# Altium schematic sheet FIT_FPGA_G-H.SchDoc
size A4; SheetNumber: 27; SheetTotal: 29
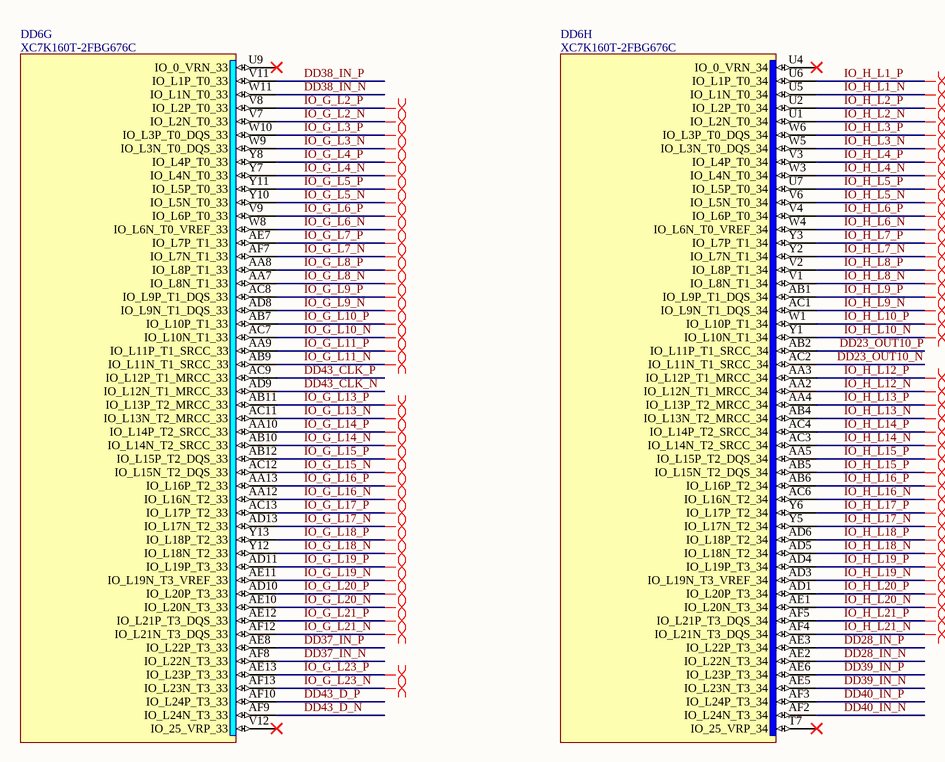
[diagram p0: FIT_FPGA_G-H.SchDoc]

## Parts
DD6  XC7K160T-2FBG676C  [BGA676C100P26X26_2700X2700X254]  (parts G,H of 15)

## Nets
DD23_OUT10_N: DD6.AC2(IO_L11N_T1_SRCC_34)
DD23_OUT10_P: DD6.AB2(IO_L11P_T1_SRCC_34)
DD28_IN_N: DD6.AE2(IO_L22N_T3_34)
DD28_IN_P: DD6.AE3(IO_L22P_T3_34)
DD37_IN_N: DD6.AF8(IO_L22N_T3_33)
DD37_IN_P: DD6.AE8(IO_L22P_T3_33)
DD38_IN_N: DD6.W11(IO_L1N_T0_33)
DD38_IN_P: DD6.V11(IO_L1P_T0_33)
DD39_IN_N: DD6.AE5(IO_L23N_T3_34)
DD39_IN_P: DD6.AE6(IO_L23P_T3_34)
DD40_IN_N: DD6.AF2(IO_L24N_T3_34)
DD40_IN_P: DD6.AF3(IO_L24P_T3_34)
DD43_CLK_N: DD6.AD9(IO_L12N_T1_MRCC_33)
DD43_CLK_P: DD6.AC9(IO_L12P_T1_MRCC_33)
DD43_D_N: DD6.AF9(IO_L24N_T3_33)
DD43_D_P: DD6.AF10(IO_L24P_T3_33)
IO_G_L2_N: DD6.V7(IO_L2N_T0_33)
IO_G_L2_P: DD6.V8(IO_L2P_T0_33)
IO_G_L3_N: DD6.W9(IO_L3N_T0_DQS_33)
IO_G_L3_P: DD6.W10(IO_L3P_T0_DQS_33)
IO_G_L4_N: DD6.Y7(IO_L4N_T0_33)
IO_G_L4_P: DD6.Y8(IO_L4P_T0_33)
IO_G_L5_N: DD6.Y10(IO_L5N_T0_33)
IO_G_L5_P: DD6.Y11(IO_L5P_T0_33)
IO_G_L6_N: DD6.W8(IO_L6N_T0_VREF_33)
IO_G_L6_P: DD6.V9(IO_L6P_T0_33)
IO_G_L7_N: DD6.AF7(IO_L7N_T1_33)
IO_G_L7_P: DD6.AE7(IO_L7P_T1_33)
IO_G_L8_N: DD6.AA7(IO_L8N_T1_33)
IO_G_L8_P: DD6.AA8(IO_L8P_T1_33)
IO_G_L9_N: DD6.AD8(IO_L9N_T1_DQS_33)
IO_G_L9_P: DD6.AC8(IO_L9P_T1_DQS_33)
IO_G_L10_N: DD6.AC7(IO_L10N_T1_33)
IO_G_L10_P: DD6.AB7(IO_L10P_T1_33)
IO_G_L11_N: DD6.AB9(IO_L11N_T1_SRCC_33)
IO_G_L11_P: DD6.AA9(IO_L11P_T1_SRCC_33)
IO_G_L13_N: DD6.AC11(IO_L13N_T2_MRCC_33)
IO_G_L13_P: DD6.AB11(IO_L13P_T2_MRCC_33)
IO_G_L14_N: DD6.AB10(IO_L14N_T2_SRCC_33)
IO_G_L14_P: DD6.AA10(IO_L14P_T2_SRCC_33)
IO_G_L15_N: DD6.AC12(IO_L15N_T2_DQS_33)
IO_G_L15_P: DD6.AB12(IO_L15P_T2_DQS_33)
IO_G_L16_N: DD6.AA12(IO_L16N_T2_33)
IO_G_L16_P: DD6.AA13(IO_L16P_T2_33)
IO_G_L17_N: DD6.AD13(IO_L17N_T2_33)
IO_G_L17_P: DD6.AC13(IO_L17P_T2_33)
IO_G_L18_N: DD6.Y12(IO_L18N_T2_33)
IO_G_L18_P: DD6.Y13(IO_L18P_T2_33)
IO_G_L19_N: DD6.AE11(IO_L19N_T3_VREF_33)
IO_G_L19_P: DD6.AD11(IO_L19P_T3_33)
IO_G_L20_N: DD6.AE10(IO_L20N_T3_33)
IO_G_L20_P: DD6.AD10(IO_L20P_T3_33)
IO_G_L21_N: DD6.AF12(IO_L21N_T3_DQS_33)
IO_G_L21_P: DD6.AE12(IO_L21P_T3_DQS_33)
IO_G_L23_N: DD6.AF13(IO_L23N_T3_33)
IO_G_L23_P: DD6.AE13(IO_L23P_T3_33)
IO_H_L1_N: DD6.U5(IO_L1N_T0_34)
IO_H_L1_P: DD6.U6(IO_L1P_T0_34)
IO_H_L2_N: DD6.U1(IO_L2N_T0_34)
IO_H_L2_P: DD6.U2(IO_L2P_T0_34)
IO_H_L3_N: DD6.W5(IO_L3N_T0_DQS_34)
IO_H_L3_P: DD6.W6(IO_L3P_T0_DQS_34)
IO_H_L4_N: DD6.W3(IO_L4N_T0_34)
IO_H_L4_P: DD6.V3(IO_L4P_T0_34)
IO_H_L5_N: DD6.V6(IO_L5N_T0_34)
IO_H_L5_P: DD6.U7(IO_L5P_T0_34)
IO_H_L6_N: DD6.W4(IO_L6N_T0_VREF_34)
IO_H_L6_P: DD6.V4(IO_L6P_T0_34)
IO_H_L7_N: DD6.Y2(IO_L7N_T1_34)
IO_H_L7_P: DD6.Y3(IO_L7P_T1_34)
IO_H_L8_N: DD6.V1(IO_L8N_T1_34)
IO_H_L8_P: DD6.V2(IO_L8P_T1_34)
IO_H_L9_N: DD6.AC1(IO_L9N_T1_DQS_34)
IO_H_L9_P: DD6.AB1(IO_L9P_T1_DQS_34)
IO_H_L10_N: DD6.Y1(IO_L10N_T1_34)
IO_H_L10_P: DD6.W1(IO_L10P_T1_34)
IO_H_L12_N: DD6.AA2(IO_L12N_T1_MRCC_34)
IO_H_L12_P: DD6.AA3(IO_L12P_T1_MRCC_34)
IO_H_L13_N: DD6.AB4(IO_L13N_T2_MRCC_34)
IO_H_L13_P: DD6.AA4(IO_L13P_T2_MRCC_34)
IO_H_L14_N: DD6.AC3(IO_L14N_T2_SRCC_34)
IO_H_L14_P: DD6.AC4(IO_L14P_T2_SRCC_34)
IO_H_L15_P: DD6.AA5(IO_L15P_T2_DQS_34) DD6.AB5(IO_L15N_T2_DQS_34)
IO_H_L16_N: DD6.AC6(IO_L16N_T2_34)
IO_H_L16_P: DD6.AB6(IO_L16P_T2_34)
IO_H_L17_N: DD6.Y5(IO_L17N_T2_34)
IO_H_L17_P: DD6.Y6(IO_L17P_T2_34)
IO_H_L18_N: DD6.AD5(IO_L18N_T2_34)
IO_H_L18_P: DD6.AD6(IO_L18P_T2_34)
IO_H_L19_N: DD6.AD3(IO_L19N_T3_VREF_34)
IO_H_L19_P: DD6.AD4(IO_L19P_T3_34)
IO_H_L20_N: DD6.AE1(IO_L20N_T3_34)
IO_H_L20_P: DD6.AD1(IO_L20P_T3_34)
IO_H_L21_N: DD6.AF4(IO_L21N_T3_DQS_34)
IO_H_L21_P: DD6.AF5(IO_L21P_T3_DQS_34)

Not connected (* = marked no-connect by the designer): DD6 T7(IO_25_VRP_34)* U4(IO_0_VRN_34)* U9(IO_0_VRN_33)* V12(IO_25_VRP_33)*

## Layout directives
differential pair: IO_G_L2_N, IO_G_L2_P, IO_G_L3_N, IO_G_L3_P, IO_G_L4_N, IO_G_L4_P, IO_G_L5_N, IO_G_L5_P, IO_G_L6_N, IO_G_L6_P, IO_G_L7_N, IO_G_L7_P, IO_G_L8_N, IO_G_L8_P, IO_G_L9_N, IO_G_L9_P, IO_G_L10_N, IO_G_L10_P, IO_G_L11_N, IO_G_L11_P, IO_G_L13_N, IO_G_L13_P, IO_G_L14_N, IO_G_L14_P, IO_G_L15_N, IO_G_L15_P, IO_G_L16_N, IO_G_L16_P, IO_G_L17_N, IO_G_L17_P, IO_G_L18_N, IO_G_L18_P, IO_G_L19_N, IO_G_L19_P, IO_G_L20_N, IO_G_L20_P, IO_G_L21_N, IO_G_L21_P, IO_G_L23_N, IO_G_L23_P, IO_H_L1_N, IO_H_L1_P, IO_H_L2_N, IO_H_L2_P, IO_H_L3_N, IO_H_L3_P, IO_H_L4_N, IO_H_L4_P, IO_H_L5_N, IO_H_L5_P, IO_H_L6_N, IO_H_L6_P, IO_H_L7_N, IO_H_L7_P, IO_H_L8_N, IO_H_L8_P, IO_H_L9_N, IO_H_L9_P, IO_H_L10_N, IO_H_L10_P, IO_H_L12_N, IO_H_L12_P, IO_H_L13_N, IO_H_L13_P, IO_H_L14_N, IO_H_L14_P, IO_H_L15_P, IO_H_L16_N, IO_H_L16_P, IO_H_L17_N, IO_H_L17_P, IO_H_L18_N, IO_H_L18_P, IO_H_L19_N, IO_H_L19_P, IO_H_L20_N, IO_H_L20_P, IO_H_L21_N, IO_H_L21_P

## Library data of the parts
DD6 = XC7K160T-2FBG676C: KINTEX-7, FPGA, 676-Ball BGA, Pb-Free; Part Description: KINTEX-7 FPGA, 162240 Logic Cells, 400 User I/O, 8 GTXs, 676-Ball BGA, Speed Grade 2, Commercial Grade, Pb-Free; Manufacturer: XILINX; PressFit: No; Bonding: No; Part Number: XC7K160T-2FBG676C; Component Kind: Standard; Component Type: Standard; Device: XC7K160T-2FBG676C; PackageDescription: BGA, 1.00mm Pitch, Square; 676 Pin, 26 Columns X 26 Rows, Body 27.0mm X 27.0mm X 2.54mm H, IPC Medium Density; Manufacturer Part Number: XC7K160T-2FBG676C; Pin Count: 676; Case: BGA676; Mounted: Yes; Socket: No; SMD: Yes; Sense: No; ComponentHeight: 2.54mm; HelpURL: \\cern.ch\dfs\Applications\Altium\Datasheets\XC7K160T-xFBG676C.pdf; ComponentLink1URL: \\cern.ch\dfs\Applications\Altium\Datasheets\XC7K160T-xFBG676C_Package-Pinout.pdf; ComponentLink1Description: Package/Pinout; Author: CERN DEM BC; CreateDate: 06.02.2020; LatestRevisionDate: 06.02.2020